# EAGLE design Arduino_S3v3_R2_a (EAGLE 7.1.0)
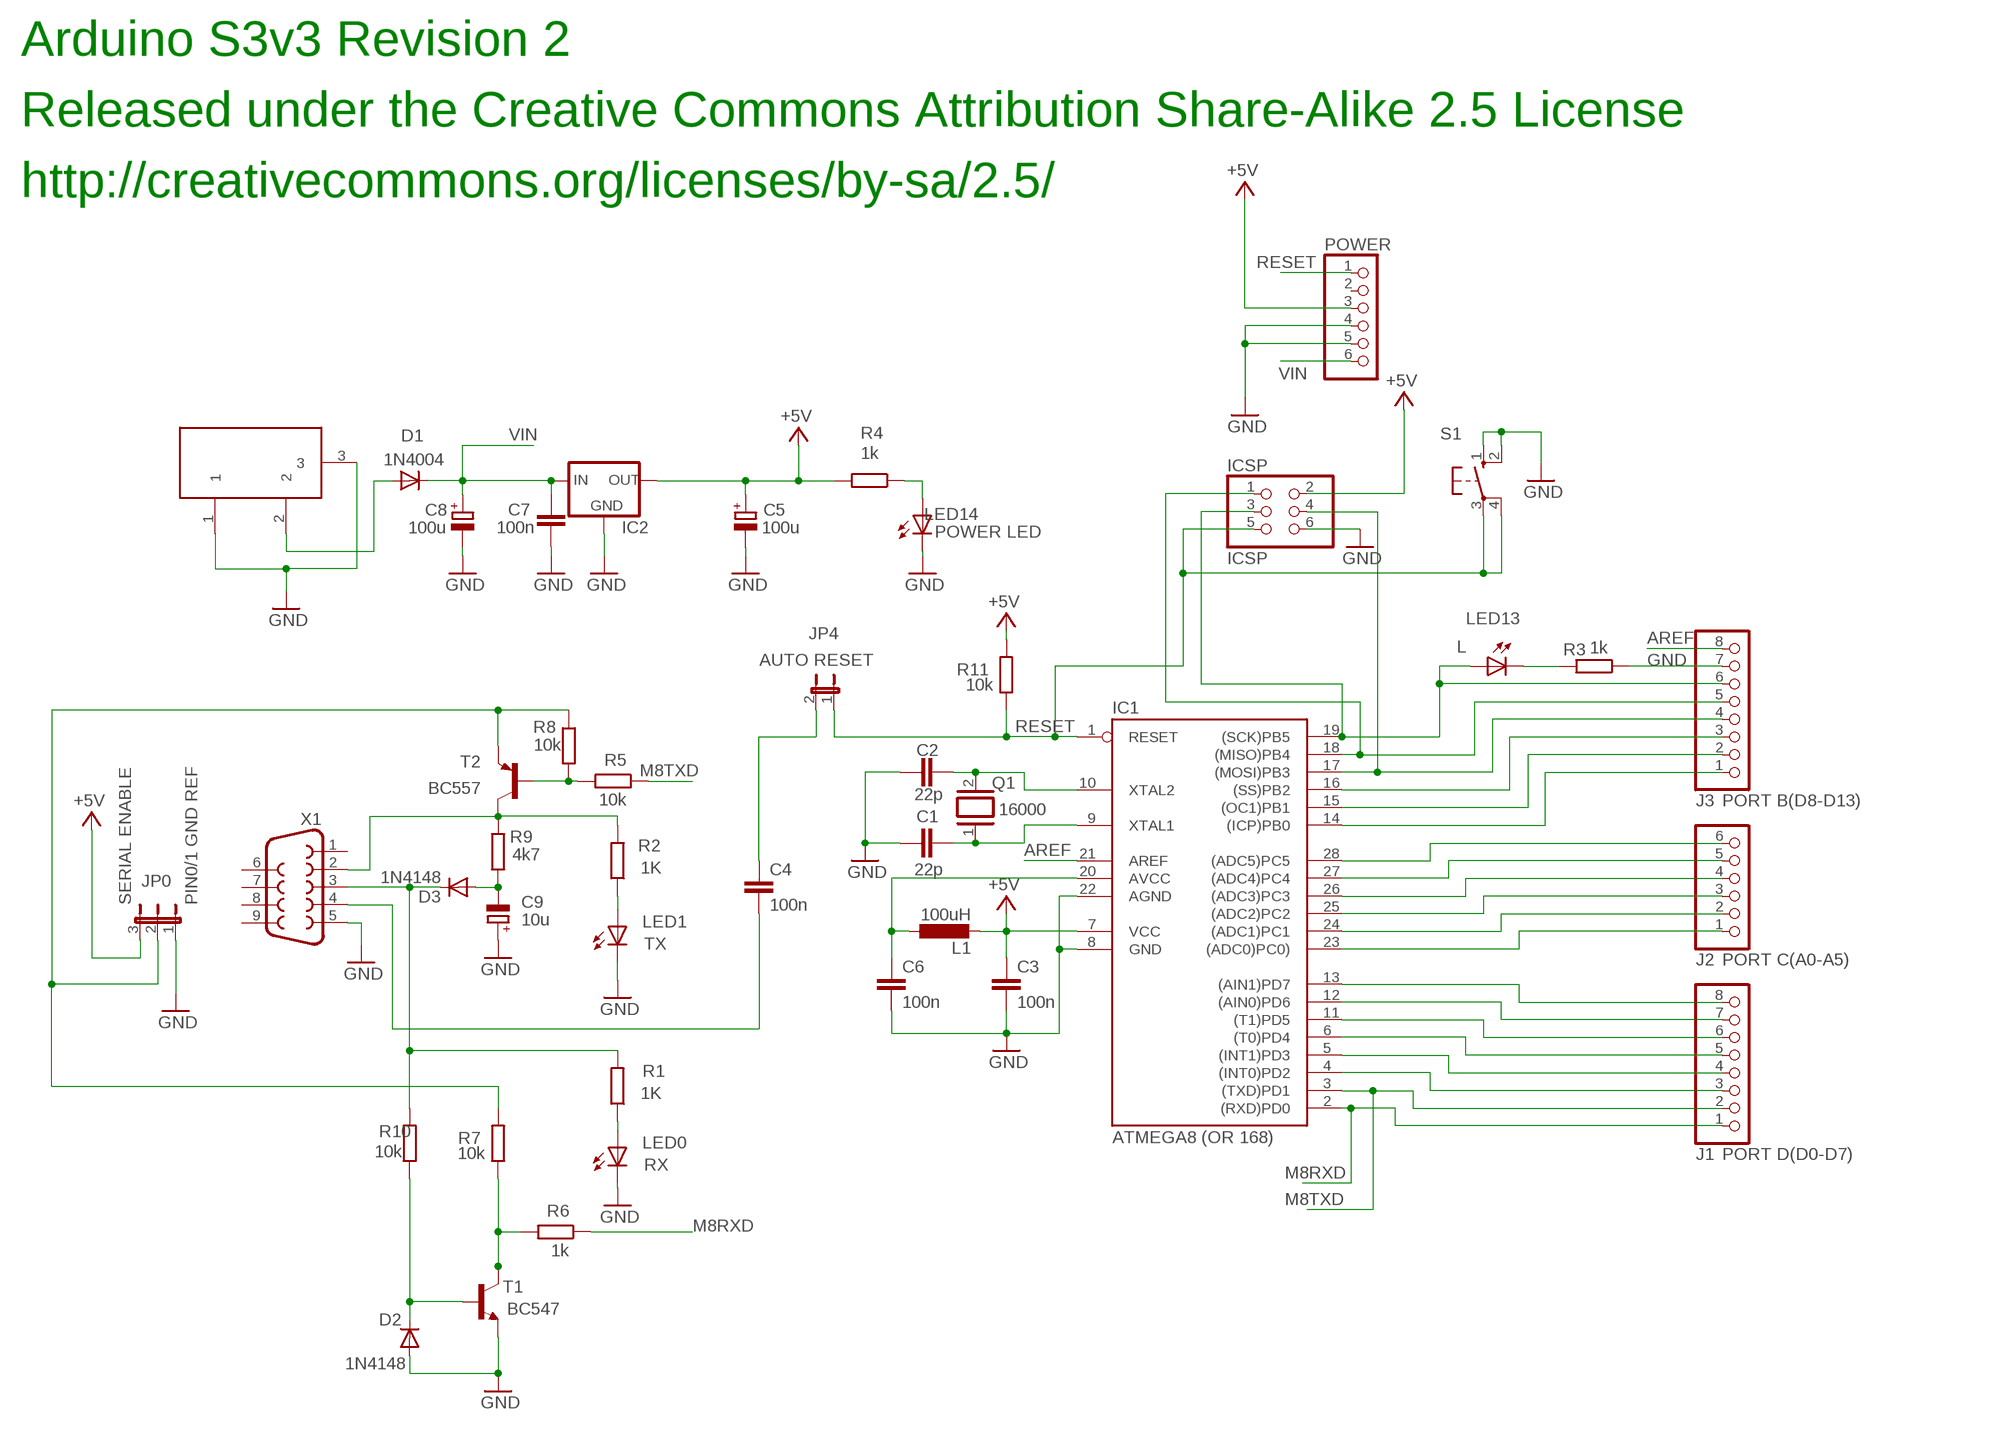
[diagram p0: schematic, sheet 1]

## Parts
C1  22p  C-EU050-025X075  [C050-025X075]
C2  22p  C-EU050-025X075  [C050-025X075]
C3  100n  C-EU050-025X075  [C050-025X075]
C4  100n  C-EU050-025X075  [C050-025X075]
C5  100u  CPOL-EUE3.5-8  [E3,5-8]
C6  100n  C-EU050-025X075  [C050-025X075]
C7  100n  C-EU050-025X075  [C050-025X075]
C8  100u  CPOL-EUE3.5-8  [E3,5-8]
C9  10u  CPOL-EUE5-6  [E5-6]
D1  1N4004  [DO41-10]
D2  1N4148  [DO35-10]
D3  1N4148  [DO35-10]
DC1  DC21MMX  [DC-21MM]
IC1  ATMEGA8 (OR 168)  AT90S4433P  [DIL28-3]
IC2  78XXL  [78XXL]
ICSP  ICSP  PINHD-2X3  [2X03]
J1  PORT D(D0-D7)  PINHD-1X8  [1X08]
J2  PORT C(A0-A5)  PINHD-1X6  [1X06]
J3  PORT B(D8-D13)  PINHD-1X8  [1X08]
JP0  JP2W  [JP2W]
JP4  AUTO RESET  JP1W  [JP1W]
L1  100uH  L-EU0207/10  [0207/10]
LED0  RX  LED3MM  [LED3MM]
LED1  TX  LED3MM  [LED3MM]
LED13  L  LED3MM  [LED3MM]
LED14  POWER LED  LED3MM  [LED3MM]
POWER  PINHD-1X6  [1X06]
Q1  16000  XTAL  [Q]
R1  1K  R-EU_0207/10  [0207/10]
R2  1K  R-EU_0207/10  [0207/10]
R3  1k  R-EU_0207/10  [0207/10]
R4  1k  R-EU_0207/10  [0207/10]
R5  10k  R-EU_0207/10  [0207/10]
R6  1k  R-EU_0207/10  [0207/10]
R7  10k  R-EU_0207/10  [0207/10]
R8  10k  R-EU_0207/10  [0207/10]
R9  4k7  R-EU_0207/10  [0207/10]
R10  10k  R-EU_0207/10  [0207/10]
R11  10k  R-EU_0207/10  [0207/10]
S1  10-XX  [B3F-10XX]
T1  BC547  [TO92]
T2  BC557  BC557B-PNP-TO92-EBC  [TO92-EBC]
X1  F09H  [F09H]

## Nets
+5V [power]: C3.1 C5.+ IC1.7(VCC) IC2.OUT ICSP.2 JP0.3 L1.2 POWER.3 R4.2 R11.2
AREF: IC1.21(AREF) J3.8
GND: C1.1 C2.1 C3.2 C5.- C6.2 C7.1 C8.- C9.+ D2.A DC1.1 DC1.3 IC1.8(GND) IC1.22(AGND) IC2.GND ICSP.6 J3.7 JP0.1 LED0.K(C) LED1.K(C) LED14.K(C) POWER.4 POWER.5 R3.1 S1.1(S) S1.2(S1) T1.1(E) X1.5
M8RXD: IC1.2((RXD)PD0) J1.1 R6.1
M8TXD: IC1.3((TXD)PD1) J1.2 R5.1
N$1: IC1.18((MISO)PB4) ICSP.1 J3.5
N$2: C9.- D3.A R9.1
N$3: LED14.A R4.1
N$4: IC1.17((MOSI)PB3) ICSP.4 J3.4
N$5: IC1.14((ICP)PB0) J3.1
N$6: C1.2 IC1.9(XTAL1) Q1.1
N$7: C2.2 IC1.10(XTAL2) Q1.2
N$8: D1.A DC1.2
N$10: IC1.4((INT0)PD2) J1.3
N$11: IC1.5((INT1)PD3) J1.4
N$12: IC1.6((T0)PD4) J1.5
N$13: IC1.11((T1)PD5) J1.6
N$14: IC1.12((AIN0)PD6) J1.7
N$15: IC1.13((AIN1)PD7) J1.8
N$16: IC1.23((ADC0)PC0)) J2.1
N$17: IC1.24((ADC1)PC1) J2.2
N$18: IC1.25((ADC2)PC2) J2.3
N$19: IC1.26((ADC3)PC3) J2.4
N$20: IC1.27((ADC4)PC4) J2.5
N$21: IC1.28((ADC5)PC5) J2.6
N$22: IC1.15((OC1)PB1) J3.2
N$23: IC1.16((SS)PB2) J3.3
N$25: D3.C R1.2 R10.2 X1.3
N$26: R6.2 R7.1 T1.3(C)
N$27: R5.2 R8.2 T2.B
N$29: D2.C R10.1 T1.2(B)
N$31: LED13.K(C) R3.2
N$32: LED1.A R2.1
N$33: LED0.A R1.1
N$34: C4.1 JP4.2
N$38: C4.2 X1.4
N$39: R2.2 R9.2 T2.C X1.2
N$42 [power]: C6.1 IC1.20(AVCC) L1.1
RESET: IC1.1(RESET) ICSP.5 JP4.1 POWER.1 R11.1 S1.3(P) S1.4(P1)
SCK: IC1.19((SCK)PB5) ICSP.3 J3.6 LED13.A
SERIAL_VCC: JP0.2 R7.2 R8.1 T2.E
VIN [power]: C7.2 C8.+ D1.C IC2.IN POWER.6
Unconnected: POWER.2 X1.1 X1.6 X1.7 X1.8 X1.9

## Notes on the sheet
- Arduino S3v3 Revision 2
- Released under the Creative Commons Attribution Share-Alike 2.5 License
- http://creativecommons.org/licenses/by-sa/2.5/
- SERIAL ENABLE | PIN0/1 GND REF

## Library data of the parts
C1-C4 C6 C7 = rcl:C-EU: CAPACITOR, European symbol
C5 C8 C9 = rcl:CPOL-EU: POLARIZED CAPACITOR, European symbol
D1 = diode:1N4004: DIODE general purpose rectifier, 1 A
D2 D3 = diode:1N4148: DIODE high speed (Philips)
DC1 = powersupply:DC21MM
IC1 = atmel:AT90S4433: MICROCONTROLLER 4 Kbytes FLASH 128 bytes SRAM 256 bytes EEPROM UART 6-channel 10 bit ADC
IC2 = v-reg:78XXL: VOLTAGE REGULATOR
ICSP = pinhead:PINHD-2X3: PIN HEADER
J1 J3 = pinhead:PINHD-1X8: PIN HEADER
J2 POWER = pinhead:PINHD-1X6: PIN HEADER
JP0 = jumper:JP2W: JUMPER
JP4 = jumper:JP1W
L1 = rcl:L-EU: INDUCTOR, European symbol
LED0 LED1 LED13 LED14 = led:LED: LED OSRAM: - CHIPLED LG R971, LG N971, LY N971, LG Q971, LY Q971, LO R971, LY R971 LH N974, LH R974 LS Q976, LO Q976, LY Q976 LO Q996 - Hyper CHIPLED LW Q18S LB Q993, LB Q99A, LB R99A - SideLED LS A670, LO A670, LY A670, LG A670, LP A670 LB A673, LV A673, LT A673, LW A673 LH A674 LY A675 LS A676, LA A676, LO A676, LY A676, LW A676 LS A679, LY A679, LG A679 - Hyper Micro SIDELED® LS Y876, LA Y876, LO Y876, LY Y876 LT Y87S - SmartLED LW L88C, LW L88S LB L89C, LB L89S, LG L890 LS L89K, LO L89K, LY L89K LS L896, LA L896, LO L896, LY L896 - TOPLED LS T670, LO T670, LY T670, LG T670, LP T670 LSG T670, LSP T670, LSY T670, LOP T670, LYG T670 LG T671, LOG T671, LSG T671 LB T673, LV T673, LT T673, LW T673 LH T674 LS T676, LA T676, LO T676, LY T676, LB T676, LH T676, LSB T676, LW T676 LB T67C, LV T67C, LT T67C, LS T67K, LO T67K, LY T67K, LW E67C LS E67B, LA E67B, LO E67B, LY E67B, LB E67C, LV E67C, LT E67C LW T67C LS T679, LY T679, LG T679 LS T770, LO T770, LY T770, LG T770, LP T770 LB T773, LV T773, LT T773, LW T773 LH T774 LS E675, LA E675, LY E675, LS T675 LS T776, LA T776, LO T776, LY T776, LB T776 LHGB T686 LT T68C, LB T68C - Hyper Mini TOPLED® LB M676 - Mini TOPLED Santana® LG M470 LS M47K, LO M47K, LY M47K Source: http://www.osram.convergy.de/
Q1 = special:XTAL: CRYSTAL
R1-R11 = rcl:R-EU_: RESISTOR, European symbol
S1 = switch-omron:10-XX: OMRON SWITCH
T1 = transistor:BC547: NPN TRANSISTOR
T2 = transistor:*-PNP-: PNP Transistror
X1 = con-subd:F09: SUB-D

## Net classes
1 power: width 0.61 mm

## Board
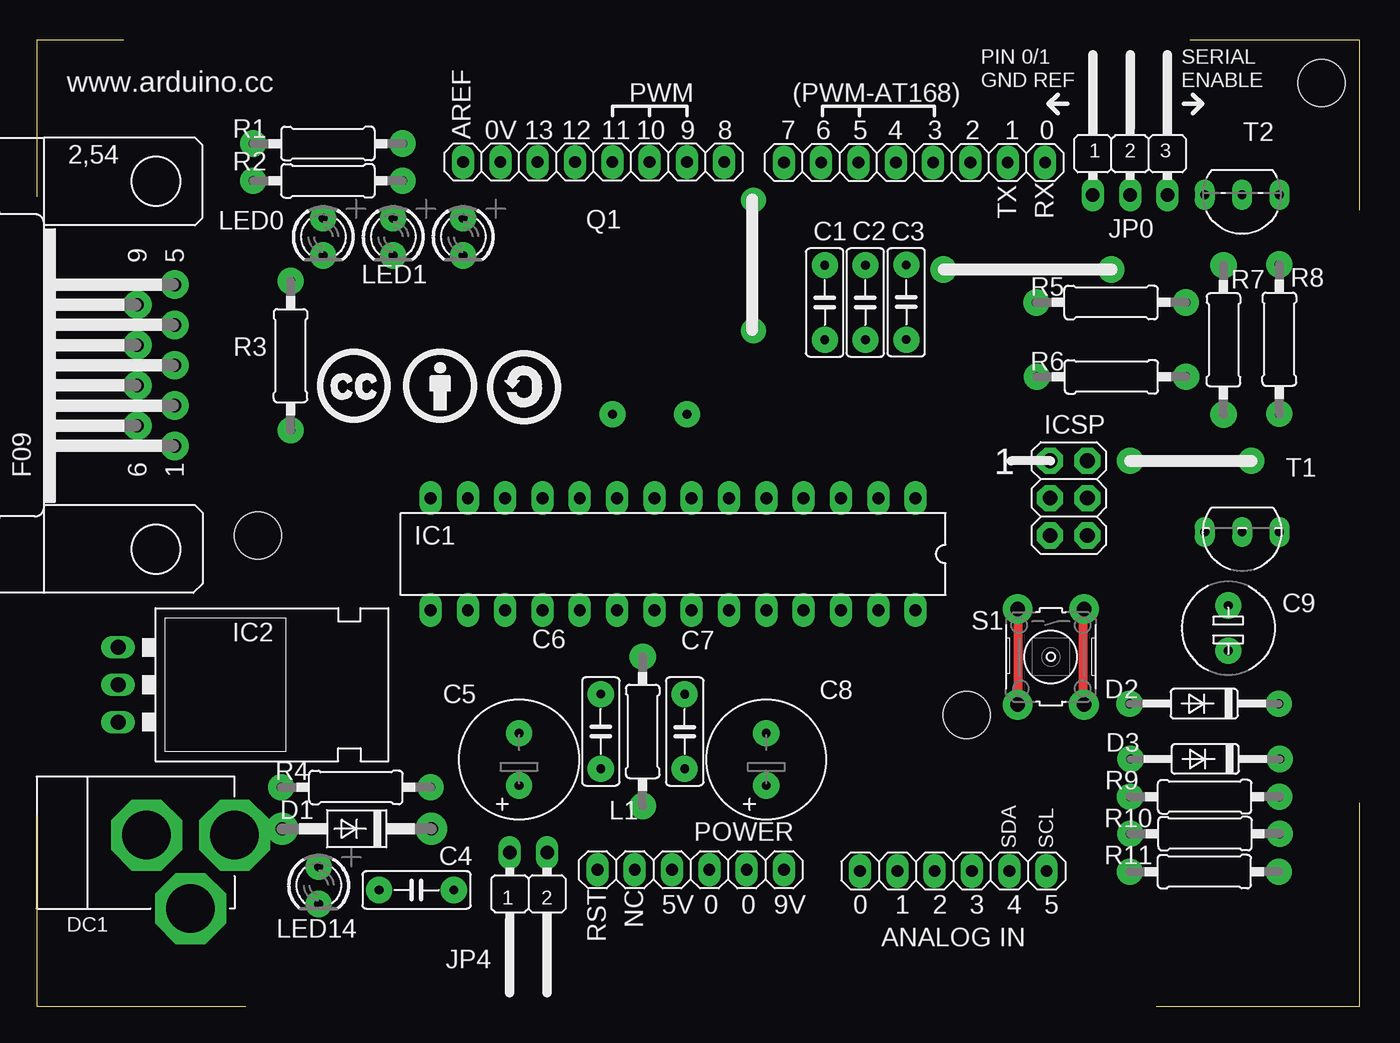
[diagram p1: board, top side]
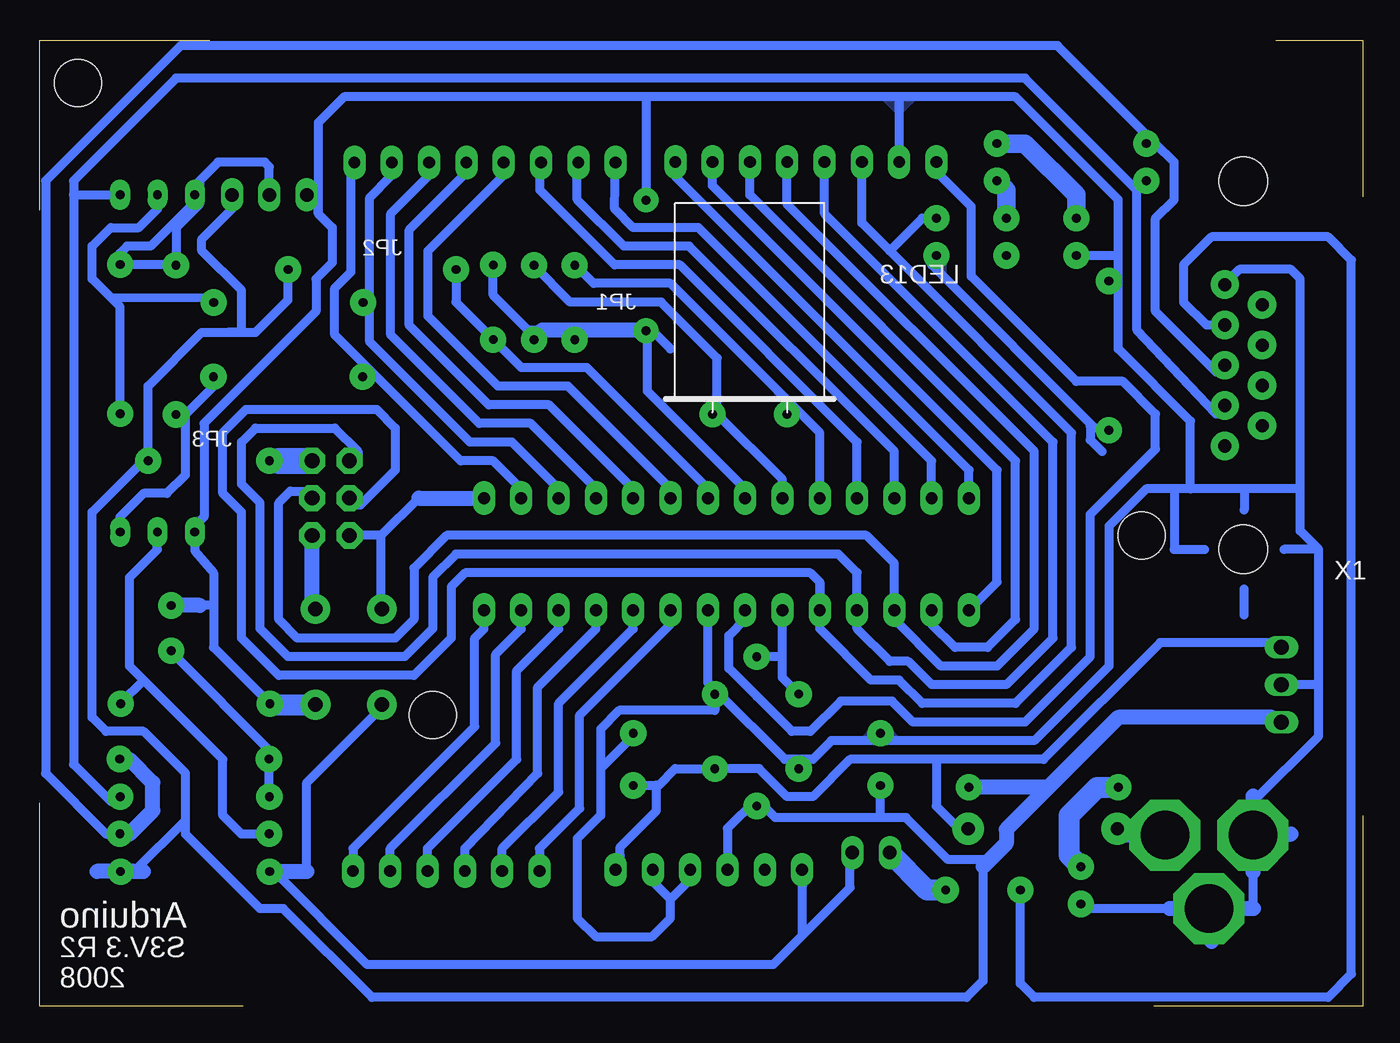
[diagram p2: board, bottom side, seen from below]

Size 90.06 x 65.74 mm. Coordinates in mm from the lower left corner, seen from the top.
Outline: 0.01,65.74 0.01,55.07
Outline: 0.01,12.95 0.01,0 14.23,0
Outline: 76.2,0 90.06,0
Outline: 90.05,65.73 78.5,65.73
Outline: 5.91,65.74 0,65.74
Outline: 90.06,0.01 90.06,13.85
Outline: 90.05,54.18 90.05,65.73
Copper layers (1*16): Top 0.035mm / dielectric 1.5mm / Bottom 0.035mm
Design rules "gizmo": minimum track width 0.6mm, minimum drill 0.6mm, track to track 0.67mm, track to pad 0.67mm, pad to pad 0.67mm, via to via 0.67mm, smd to smd 0mil, copper to edge 0mil, drill to drill 8mil, minimum pad ring 10mil, minimum via ring 8mil, stop-mask expansion 0mil, vias tented up to drill 0mil, thermal gap 10mil
Holes 3.2 mm at 87.45,62.83 63.32,19.81 15.06,32.03
bRestrict: 6 lines

### Footprints (pad centres in the part's own frame; a part is rotated, then mirrored left to right if it is on the bottom)
C050-025X075 = drill 0.6 pad 1.778: 1 -2.54,0; 2 2.54,0
E3,5-8 = drill 0.6 pad 1.778: + -1.778,0; - 1.778,0
E5-6 = drill 0.6 pad 1.778: + -1.54,0; - 1.54,0
DO41-10 = drill 0.9 pad 2.159: A 5.08,0; C -5.08,0
DO35-10 = drill 0.6 pad 1.778: A 5.08,0; C -5.08,0
DC-21MM = drill 3.302 pad 4.826 octagon: 1 -5.08,-3.353; 2 -0.076,-6.35; 3 -0.076,-0.356
DIL28-3 = drill 0.813 pad 1.524 long: 1 -16.51,-3.81; 2 -13.97,-3.81; 3 -11.43,-3.81; 4 -8.89,-3.81; 5 -6.35,-3.81; 6 -3.81,-3.81; 7 -1.27,-3.81; 8 1.27,-3.81; 9 3.81,-3.81; 10 6.35,-3.81; 11 8.89,-3.81; 12 11.43,-3.81; 13 13.97,-3.81; 14 16.51,-3.81; 15 16.51,3.81; 16 13.97,3.81; 17 11.43,3.81; 18 8.89,3.81; 19 6.35,3.81; 20 3.81,3.81; 21 1.27,3.81; 22 -1.27,3.81; 23 -3.81,3.81; 24 -6.35,3.81; 25 -8.89,3.81; 26 -11.43,3.81; 27 -13.97,3.81; 28 -16.51,3.81
78XXL = drill 1.016 long: GND 0,-3.81; IN -2.54,-3.81; OUT 2.54,-3.81
2X03 = drill 1 pad 1.778 octagon: 1 -2.54,-1.27; 2 -2.54,1.27; 3 0,-1.27; 4 0,1.27; 5 2.54,-1.27; 6 2.54,1.27
1X08 = drill 0.8 pad 1.524 long: 1 -8.89,0; 2 -6.35,0; 3 -3.81,0; 4 -1.27,0; 5 1.27,0; 6 3.81,0; 7 6.35,0; 8 8.89,0
1X06 = drill 0.8 pad 1.524 long: 1 -6.35,0; 2 -3.81,0; 3 -1.27,0; 4 1.27,0; 5 3.81,0; 6 6.35,0
JP2W = drill 0.914 pad 1.524 long: 1 -2.54,-1.27; 2 0,-1.27; 3 2.54,-1.27
JP1W = drill 0.914 pad 1.524 long: 1 -1.27,-1.905; 2 1.27,-1.905
0207/10 = drill 0.6 pad 1.778: 1 -5.08,0; 2 5.08,0
LED3MM = drill 0.6 pad 1.778: A -1.27,0; K 1.27,0
Q = drill 0.6 pad 1.778: 1 -2.54,-7.62; 2 2.54,-7.62
B3F-10XX = drill 1 pad 2.032: 1 -3.251,2.261; 2 3.251,2.261; 3 -3.251,-2.261; 4 3.251,-2.261
TO92 = drill 0.6 pad 1.372 long: 1 2.54,0; 2 0,0; 3 -2.54,0
TO92-EBC = drill 0.6 pad 1.372 long: B 0,-1.27; C -2.54,-1.27; E 2.54,-1.27
F09H = drill 0.9 pad 1.93: 1 -5.486,-1.27; 2 -2.743,-1.27; 3 0,-1.27; 4 2.743,-1.27; 5 5.486,-1.27; 6 -4.115,1.27; 7 -1.372,1.27; 8 1.372,1.27; 9 4.115,1.27 | hole 3.302: -12.522,0; 12.522,0

### Placement (x,y rotation side)
C1  56.41,47.88 90 top
C2  53.65,47.88 90 top
C3  59.2,47.9 90 top
C4  25.86,7.9 180 top
C5  32.84,16.79 90 top
C6  38.4,18.7 270 top
C7  44.11,18.69 270 top
C8  49.67,16.79 90 top
C9  81.11,25.73 270 top
D1  21.79,12.07 180 top
D2  79.48,20.58 180 top
D3  79.54,16.81 180 top
DC1  7.12,11.71 90 top
IC1  43.32,30.76 180 top
IC2  9.35,21.87 270 top
ICSP  70.25,34.57 270 top
J1  59.75,57.41 180 top
J2  62.4,9.2 0 top
J3  37.91,57.45 180 top
JP0  74.43,56.48 0 top
JP4  33.48,8.54 180 top
L1  41.25,18.7 270 top
LED0  19.51,52.35 270 top
LED1  24.27,52.35 270 top
LED13  29.03,52.35 270 top
LED14  19.19,8.22 270 top
POWER  44.52,9.28 0 top
Q1  41.73,47.91 0 bottom
R1  19.82,58.7 180 top
R2  19.82,56.16 180 top
R3  17.28,44.26 270 top
R4  21.73,14.89 0 top
R5  73.14,47.89 0 top
R6  73.16,42.83 0 top
R7  80.79,45.34 90 top
R8  84.59,45.39 270 top
R9  79.51,14.25 0 top
R10  79.53,11.74 0 top
R11  79.49,9.16 0 top
S1  69.04,23.77 270 top
T1  82.06,32.26 180 top
T2  82.05,53.95 180 top
U$1  [CC]  19.03,39.65 0 top
U$2  [BY]  24.9,39.65 0 top
U$3  [SA]  30.62,39.65 0 top
X1  8.12,43.61 90 top

### Tracks (layer width: path | path; a pad name or v marks a point on that pad's centre or on a via)
+5V  (via drill 0.6 pad 1.78, 0.61 pad 1.78)
  Top 0.6: v73.16,50.13 v61.73,50.13 | v82.69,37.11 v74.43,37.11
  Bottom 0.6: 80.15,12.66 80.15,15.84 83,18.7 85.55,18.7 86.5,19.65 86.5,33.62 83,37.11 v82.69,37.11 82.69,42.19 79.04,45.84 76.34,45.84 | v74.43,37.11 73.8,37.11 v74.43,37.11 | POWER.3 43.25,12.1 41.25,14.09 | IC2.OUT 6.17,19.65 | 80.15,12.66 83.64,9.17 | C3.1 57.29,43.46 52.84,43.46 44.59,35.21 | C3.1 61.73,47.91 v61.73,50.13 | 80.15,12.66 80.15,11.71 75.07,6.63 73.48,6.63 67.45,0.6 26.97,0.6 25.85,1.71 25.85,9.49 25.85,9.97 28.24,9.97 31.09,12.82 | JP0.3 76.97,54.26 79.04,52.19 79.04,51.4 76.34,48.7 76.34,45.84 | v73.16,50.13 73.16,48.07 75.38,45.84 76.34,45.84 | 76.34,45.84 77.29,45.84 | R4.2 | 31.09,12.82 | C3.1 59.19,45.53 C3.1 | 44.59,35.21 | 41.25,14.09 | 31.09,12.82 32.84,12.82 | 32.84,12.82 39.98,12.82 41.25,14.09 | C5.+ 32.84,12.82 | 44.59,35.21 IC1.7
  Bottom 1.016: 21.41,14.89 16.65,19.65 6.17,19.65 | 21.41,14.89 24.27,12.03 24.27,11.08 25.85,9.49 | 83,9.17 83.64,9.17 86.18,9.17 | 21.41,14.89 R4.2
  Bottom 1.778: 73.8,37.11 ICSP.2
AREF
  Bottom 0.6: IC1.21 42.05,26.64 42.05,26.32 43.16,25.21 43.16,22.98 41.25,21.08 38.87,18.7 37.6,18.7 35.54,20.76 32.05,20.76 30.62,19.33 23,19.33 18.55,23.78 18.55,33.46 14.11,37.91 14.11,40.29 16.33,42.51 19.5,42.51 26.65,49.65 26.65,54.42 28.71,56.48 28.71,57.43 J3.8
GND  (via drill 0.6 pad 1.68, 1 pad 2.03)
  Top 0.6: 48.72,54.85 48.72,45.96 v48.79,45.96 | 48.72,54.85 48.72,54.89 | v48.79,54.85 48.72,54.85 | 71.26,20.6 S1.2 | 71.26,20.6 71.26,26.95 S1.1 | S1.2 71.26,20.6
  Bottom 0.6: D2.A 74.41,20.52 | 74.39,20.56 D2.A | 74.39,20.56 78.24,24.41 78.24,27.27 | 79.51,32.67 78.88,33.3 78.88,39.65 71.26,47.27 71.26,49.5 70.15,50.61 70.15,52.99 71.1,53.94 | 79.51,32.67 79.51,31 78.24,29.49 78.24,27.27 | 42.05,35.21 | 42.05,35.21 48.72,41.87 48.72,46 48.75,46 v48.79,45.96 | 48.79,61.88 v48.79,54.85 | X1.5 9.39,49.13 8.39,50.13 4.9,50.13 4.26,49.49 4.26,35.21 | 11.73,35.21 11.73,39.81 16.65,44.73 16.65,51.08 | 16.65,51.08 16.65,54.89 23.63,61.88 31.57,61.88 | J3.7 31.57,57.12 31.57,61.88 | 31.57,61.88 48.79,61.88 | 4.26,35.21 8.07,35.21 | 8.07,35.21 11.73,35.21 | 11.73,35.21 12.84,35.21 | 2.99,21.87 2.99,31.08 | 2.99,31.08 4.26,32.35 4.26,35.21 | 78.24,27.27 79.16,27.27 | 13.16,6.64 10.5,6.64 | 13.16,6.64 13.47,6.63 19.19,6.64 LED14.K | 44.11,20.13 50.62,20.13 51.89,18.86 51.89,16.16 | 51.89,16.16 51.89,12.98 53.48,11.4 53.48,6 52.21,4.73 48.4,4.73 47.13,6 47.13,7.27 | 2.99,21.87 IC2.GND | 10.3,6.63 13.16,6.64 | 7.44,6.63 7.44,11.71 7.47,13.62 | 2.99,21.87 2.99,18.38 7.44,13.94 7.47,13.62 | 7.47,13.62 7.48,14.29 | D2.A 74.43,20.58 74.43,20.6 74.39,20.56 | 74.39,20.56 74.35,20.52 | 71.3,26.95 71.26,26.95 71.52,27.22 | 47.13,7.27 48.4,8.54 48.4,9.17 48.33,9.17 POWER.5 | POWER.4 45.79,8.61 47.13,7.27 | 16.65,51.08 LED0.K | 47.13,44.73 48.4,46 | 48.79,61.88 69.35,61.88 71.1,60.13 71.1,53.94 | 71.1,53.94 71.1,55.21 JP0.1 | T1.1 79.53,32.67 79.51,32.67 | 12.84,35.21 14.74,35.21 17.28,32.67 17.28,23.14 22.36,18.06 32.84,18.06 | 12.84,35.21 12.84,31.08 10.77,31.08 | 2.99,31.08 5.38,31.08 | 8.07,35.21 8.07,33.78 | 8.07,26.64 8.07,28.38 | 32.84,18.06 36.17,18.06 37.44,16.79 38.4,16.79 C6.2 38.4,16.79 39.34,16.79 43.95,21.4
  Bottom 0.6: C5.- 32.84,18.06 | 55.86,46 56.81,46 59.19,48.39 59.19,50.13 59.19,50.28 C3.2 | 43.95,21.4 44.43,21.87 44.46,21.87 44.11,20.6 44.11,20.13 | C7.1 44.11,20.92 44.11,20.13 | C8.- 49.67,18.38 51.89,16.16 | 43.95,21.4 | IC1.22 44.59,22.03 43.95,21.4 | 53.64,46 53.64,45.84 53.65,45.83 C2.1 | 42.05,35.21 IC1.8
  Bottom 1.016: 79.16,27.27 C9.+ | 7.48,14.29 7.48,9.11 | S1.1 71.3,26.95 | 71.52,27.22 ICSP.6 | 4.9,11.71 7.44,11.71 9.35,11.71 | 7.44,6.63 10.3,6.63 | 10.3,6.63 13.16,6.63 | 10.3,6.63 10.3,4.41 | 56.49,45.37 55.87,45.99 | 55.87,45.99 55.86,46 | 48.72,46 53.64,46 55.87,45.99
  Bottom 1.422: 74.35,20.52 S1.2
  other vias: 71.3,20.52
  pour Bottom: 30.62,61.88 31.57,60.92 32.52,61.88
  pour Bottom (no thermals): 32.84,19.17 31.73,18.06 33.95,18.06
M8RXD
  Bottom 0.6: IC1.2 57.29,35.21 59.19,37.11 61.41,37.11 67.76,43.46 | 67.76,43.46 R6.1 | 67.76,43.46 69.99,45.69 69.99,48.86 68.88,49.97 68.88,56.96 68.64,57.36 J1.1
M8TXD
  Bottom 0.6: IC1.3 54.75,35.21 57.92,38.38 60.78,38.38 67.29,44.89 67.61,45.21 67.61,47.91 | J1.2 66.1,56.55 66.18,56.48 67.61,55.03 67.61,47.91 | R5.1 68.04,47.91 67.61,47.91
N$1
  Bottom 0.6: ICSP.1 68.4,37.11 68.4,37.75 69.99,39.34 75.39,39.34 76.34,38.38 76.34,35.52 75.07,34.25 75.07,25.68 73.16,23.78 65.23,23.78 63.32,25.68 63.32,29.18 61.73,30.76 35.7,30.76 34.43,29.49 IC1.18 34.43,25.68 32.21,23.46 30.93,23.46 29.35,21.87 24.27,21.87 21.09,25.05 21.09,38.38 36.64,53.93 J3.5
N$2
  Bottom 0.6: C9.- 80.79,23.79 74.43,17.43 74.43,16.81 | R9.1 | R9.1 74.45,14.26 | 74.43,16.81 D3.A | R9.1 74.43,16.81
N$3  (1 unrouted)
  Bottom 0.6: R4.1
  Bottom 1.422: R4.1 18.08,14.89 19.98,12.98 19.98,10.28 LED14.A
N$4
  Bottom 0.6: ICSP.4 71.58,35.05 73,35.05 73.8,34.25 73.8,26.32 72.53,25.05 65.86,25.05 64.59,26.32 64.59,29.81 62.37,32.03 33.79,32.03 31.89,30.13 IC1.17 31.89,26.32 28.71,23.14 24.9,23.14 22.36,25.68 22.36,37.75 39.18,54.57 J3.4
N$5
  Bottom 0.6: IC1.14 26.81,36.48 46.81,56.48 46.81,57.12 J3.1
N$6
  Bottom 0.6: IC1.9 39.51,35.84 43.95,40.29 | 43.95,40.29 Q1.1 | 43.95,40.29 43.95,44.1 47.76,47.91 53.95,47.91 56.49,50.45 C1.2
N$7
  Bottom 0.6: 38.87,40.92 39.83,41.88 | 38.87,40.92 47.13,49.18 52.37,49.18 53.64,50.45 53.65,50.45 C2.2 | IC1.10 36.97,39.02 38.87,40.92 | 38.87,40.92 Q1.2
N$8
  Bottom 0.6: 16.65,12.03 16.65,12.07
  Bottom 1.016: 16.65,12.07 D1.A | DC1.2 16.25,11.64 16.65,12.03
N$10
  Bottom 0.6: IC1.4 52.21,35.21 56.65,39.65 60.15,39.65 66.18,45.68 66.18,53.94 63.64,56.48 63.64,57.43 J1.3
N$11
  Bottom 0.6: IC1.5 49.67,35.21 55.38,40.92 59.51,40.92 64.91,46.32 64.91,52.83 61.1,56.64 61.1,57.43 J1.4
N$12
  Bottom 0.6: IC1.6 47.13,35.21 54.11,42.19 58.87,42.19 63.64,46.95 63.64,51.4 58.56,56.48 58.56,57.43 J1.5
N$13
  Bottom 0.6: IC1.11 34.43,38.38 46.49,50.45 50.94,50.45 56.02,55.53 56.02,57.41 | 56.02,57.41 56.02,57.43 | 56.02,57.41 J1.6
N$14
  Bottom 0.6: IC1.12 31.89,37.75 45.86,51.72 50.3,51.72 53.48,54.89 53.48,57.41 | 53.48,57.41 53.48,57.43 | 53.48,57.41 J1.7
N$15
  Bottom 0.6: IC1.13 29.35,37.11 45.22,52.99 49.67,52.99 50.94,54.26 J1.8
N$16
  Bottom 0.6: IC1.23 47.13,26 53.32,19.81 53.32,13.46 56.05,10.73 J2.1
N$17
  Bottom 0.6: IC1.24 49.67,25.68 54.75,20.6 54.75,14.57 58.59,10.73 J2.2
N$18
  Bottom 0.6: IC1.25 52.21,25.68 56.18,21.71 56.18,15.84 61.13,10.73 J2.3
N$19
  Bottom 0.6: IC1.26 54.75,25.68 57.61,22.82 57.61,16.79 63.67,10.73 J2.4
N$20
  Bottom 0.6: IC1.27 57.29,25.68 59.03,23.94 59.03,17.9 66.21,10.73 J2.5
N$21
  Bottom 0.6: IC1.28 59.83,25.68 60.46,25.05 60.46,19.02 68.75,10.73 J2.6
N$22
  Bottom 0.6: IC1.15 24.9,28.86 24.9,36.48 44.27,55.84 44.27,57.12 J3.2
N$23
  Bottom 0.6: IC1.16 29.35,26 27.76,24.41 25.54,24.41 23.63,26.32 23.63,37.11 41.73,55.21 41.73,57.12 | 41.73,57.12 41.73,57.43 | 41.73,57.12 J3.3
N$25
  Bottom 0.6: 83.93,11.74 R10.2 83.96,11.71 | D3.C 84.59,16.79 83.96,16.79 | 84.59,11.71 85.55,11.71 89.67,15.84 89.67,56.16 80.47,65.37 20.77,65.37 14.11,58.7 | X1.3 9.35,43.3 9.35,43.15 9.98,43.15 14.11,47.27 14.11,53.62 12.84,54.89 12.84,57.43 14.11,58.7 | 14.11,58.7 R1.2
  Bottom 1.016: 83.93,11.74 82.37,13.3 82.37,15.2 83.96,16.79 | 84.59,11.71 83.96,11.71
N$26
  Bottom 0.6: T1.3 84.6,32.66 84.59,33.3 83,34.89 81.42,34.89 80.15,36.16 80.15,40.29 | 80.15,40.29 78.24,42.19 R6.2 | R7.1 80.77,40.29 80.15,40.29
N$27
  Bottom 0.6: R5.2 78.58,48.2 85.23,48.23 | R8.2 84.59,40.29 R8.2 | 85.23,48.23 84.59,47.59 R8.2 | 85.23,48.23 86.5,49.49 86.5,51.72 85.23,52.99 83.32,52.99 82.05,54.26 T2.B
N$29
  Bottom 0.6: R10.1 74.75,11.71 76.34,11.71 77.61,12.98 77.61,16.79 83,22.19 | T1.2 82.06,31.07 83.96,29.18 83.96,23.14 83,22.19 | D2.C 84.55,20.64 83,22.19
N$31
  Bottom 0.6: 18.24,39.34 29.35,50.45 29.35,51.08 LED13.K | R3.2 | R3.2 | R3.2 17.28,39.34 18.24,39.34 | 17.76,37.75 18.55,38.54 18.55,39.49 18.39,39.34 18.24,39.34
  pour Bottom (no thermals): 28.4,51.08 28.4,49.49 29.35,50.45 29.35,51.08
N$32
  Bottom 1.27: LED1.A 24.27,55.53 R2.1
N$33
  Bottom 1.27: LED0.A 19.5,55.21 23,58.7 R1.1
N$34
  Bottom 1.422: C4.1 29.67,7.9 JP4.2
N$38
  Bottom 0.6: X1.4 10.65,46.36 12.2,47.91 12.2,50.45 10.3,52.35 2.36,52.35 0.77,50.77 0.77,2.19 2.36,0.6 22.36,0.6 23.32,1.55 C4.2 | C4.2
N$39
  Bottom 0.6: 84.59,13.94 85.23,13.94 87.77,16.46 87.77,55.21 | 84.59,13.94 84.61,14.26 | 15.38,55.53 23,63.15 80.78,63.15 87.77,56.16 87.77,55.21 | 15.38,55.53 15.38,46 9.98,40.29 9.35,40.29 9.35,40.55 X1.2 | 15.38,55.53 R2.2 | R9.2 85.23,14.25 84.59,13.94 | T2.C 87.76,55.22 87.77,55.21
N$42
  Bottom 0.6: 39.51,23.78 39.51,22.35 C6.1 | 39.51,23.78 IC1.20 | 39.51,23.78 | 39.51,23.78 L1.1
RESET
  Top 0.6: S1.3 66.81,26.95 66.81,20.6 S1.4
  Bottom 0.6: 66.81,32.03 64.27,34.57 | 66.81,32.03 ICSP.5 | 34.9,8.06 38.08,4.89 38.14,4.95 38.14,8.22 POWER.1 | 71.89,9.17 71.89,15.2 66.81,20.28 66.81,20.6 S1.4 | 74.43,9.17 74.43,9.16 R11.1 | S1.3 66.78,26.95 66.81,26.95 66.81,32.03 | 34.9,8.06 40.14,2.82 67.76,2.82 74.11,9.17 | 34.9,8.06 34.9,9.81 34.9,10.44 JP4.1
  Bottom 1.016: 64.27,34.57 IC1.1 | 71.89,9.17 74.11,9.17 74.43,9.17
SCK
  Bottom 0.6: 36.97,28.86 IC1.19 | 36.97,28.86 37.6,29.49 61.1,29.49 62.05,28.54 62.05,25.05 64.59,22.51 73.8,22.51 76.34,25.05 76.34,33.62 77.61,34.89 77.61,39.02 76.02,40.6 67.13,40.6 65.86,39.34 65.86,36.48 67.76,34.57 68.24,34.1 68.88,34.1 68.88,34.57 ICSP.3 | 36.97,28.86 36.97,25.68 33.48,22.19 31.57,22.19 29.98,20.6 23.63,20.6 19.82,24.41 19.82,39.02 32.21,51.4 | 32.21,51.4 34.11,53.3 | J3.6 34.11,57.43 34.11,53.3 | 34.11,53.3 34.11,53.62 | LED13.A 29.98,53.62 32.21,51.4
SERIAL_VCC
  Bottom 0.6: 84.59,50.45 R8.1 | 80.82,50.45 R7.2 80.79,50.45 80.78,50.45 | 79.19,55.05 T2.E 79.19,55.21 79.2,55.21 79.2,56.16 77.92,57.43 74.75,57.43 74.43,57.12 JP0.2 | 79.19,55.05 79.19,54.58 80.78,52.99 80.78,50.45 | 84.59,50.45 84.59,51.24 84.12,51.72 82.53,51.72 79.2,55.05 79.19,55.05 | 80.78,50.45 84.59,50.45
VIN
  Bottom 0.6: IC2.IN 6.17,24.73 13.79,24.73 21.73,16.79 29.03,16.79 | D1.C 27.48,12.07 29.03,13.62 29.03,16.79 | C7.2 41.09,16.16 39.19,14.25 37.44,14.25 34.9,16.79 29.03,16.79 | 48.08,15.01 47.95,15.01 46.81,16.16 C7.2 | 48.08,15.01 C8.+ | POWER.6 50.87,9.56 50.54,9.89 50.55,10.83 48.08,13.3 48.08,15.01 | 48.08,15.01 48.08,15.05

### Text on the board
tNames: PIN 0/1 | SERIAL | www.arduino.cc | GND REF | ENABLE | PWM | (PWM-AT168) | AREF | 0V | 13 | 12 | 11 | 10 | 9 | 8 | 7 | 6 | 5 | 4 | 3 | 2 | 1 | 0 | TX | RX | 1 | SDA | SCL | 5V | 0 | 0 | 9V | 0 | 1 | 2 | 3 | 4 | 5 | NC | RST | ANALOG IN
bNames: JP2 | LED13 | JP1 | JP3 | Arduino | S3V.3 R2 | 2008
bValues: ENABLE
bRestrict: Arduino | R.2 | V.3 | S3 | Pin0/1 | 2008 | REF | GND | SERIAL | ON | www.arduino.cc | AKASHI | A. | BANZI | M. | AUTO | CUARTIELLES | D. | CC BY SA 2.5 | RESET | ENABLE | MARTINO | G. | IGOE | T. | ZAMBETTI | N. | MELLIS | D.
tCredits: ADILSON AKASHI | MASSIMO BANZI | DAVID CUARTIELLES | TOM IGOE | GIANLUCA MARTINO | DAVID A. MELLIS | NICHOLAS ZAMBETTI | Released under the Creative Commons Attribution Share-Alike 2.5 License | http://creativecommons.org/licenses/by-sa/2.5/
Cooper Text: A | 0 | 13 | 12 | 11 | 10 | 9 | 8 | 7 | 6 | 5 | 4 | 3 | 2 | 1 | 0 | 1 | R | 5 | 0 | 0 | 9 | 0 | 1 | 2 | 3 | 4 | 5 | Analog in
bCredits: ADILSON AKASHI | MASSIMO BANZI | DAVID CUARTIELLES | TOM IGOE | GIANLUCA MARTINO | DAVID A. MELLIS | NICHOLAS ZAMBETTI | Released under the Creative Commons Attribution Share-Alike 2.5 License | http://creativecommons.org/licenses/by-sa/2.5/